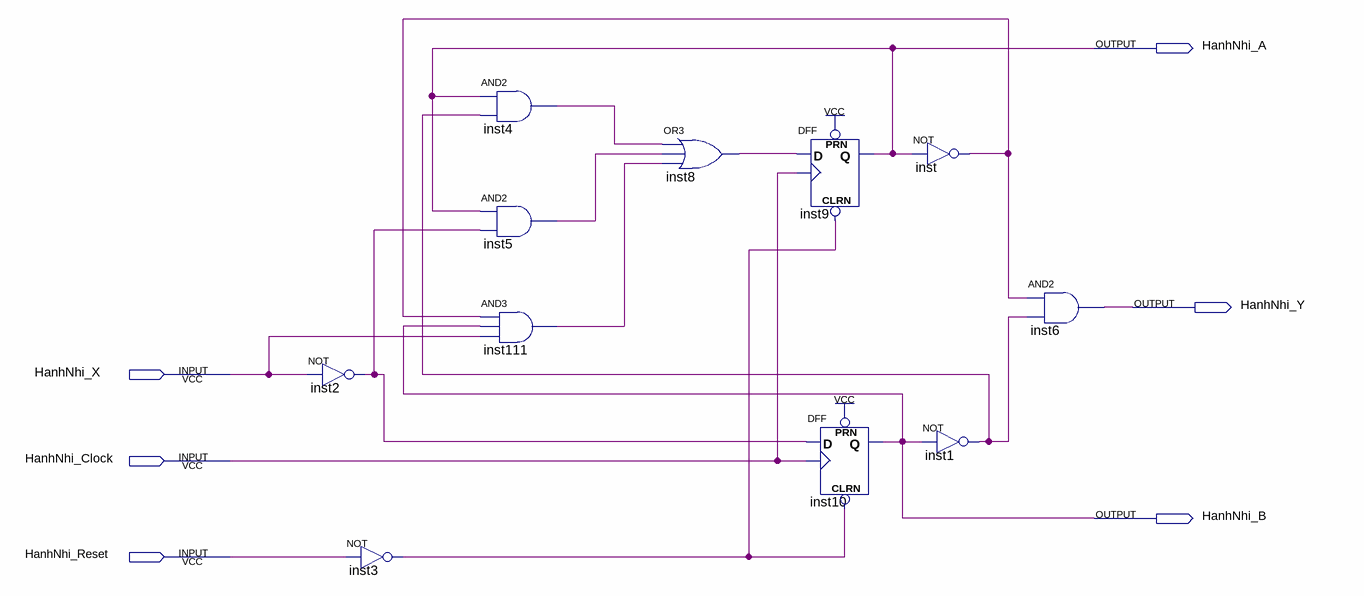
[diagram p0: schematic sheet]
// Quartus schematic Assignment2.bdf as structural Verilog: 11 symbols, 6 pins
module Assignment2 (
  input  HanhNhi_X,
  input  HanhNhi_Clock,
  input  HanhNhi_Reset,
  output HanhNhi_A,
  output HanhNhi_Y,
  output HanhNhi_B
);

  wire inst1_out, inst2_out, inst3_out, inst4_out, inst5_out, inst8_out, inst111_out, inst_out;

  not inst2 (inst2_out, HanhNhi_X);
  not inst3 (inst3_out, HanhNhi_Reset);
  and inst4 (inst4_out, HanhNhi_A, inst1_out);
  and inst5 (inst5_out, HanhNhi_A, inst2_out);
  and inst111 (inst111_out, inst_out, HanhNhi_B, HanhNhi_X);
  or inst8 (inst8_out, inst4_out, inst5_out, inst111_out);
  DFF inst9 (.CLRN(inst3_out), .CLK(HanhNhi_Clock), .D(inst8_out), .PRN(1'b1), .Q(HanhNhi_A));
  DFF inst10 (.CLRN(inst3_out), .CLK(HanhNhi_Clock), .D(inst2_out), .PRN(1'b1), .Q(HanhNhi_B));
  not inst (inst_out, HanhNhi_A);
  not inst1 (inst1_out, HanhNhi_B);
  and inst6 (HanhNhi_Y, inst_out, inst1_out);
endmodule
